# Altium project PCB_Emergencia.PrjPcb
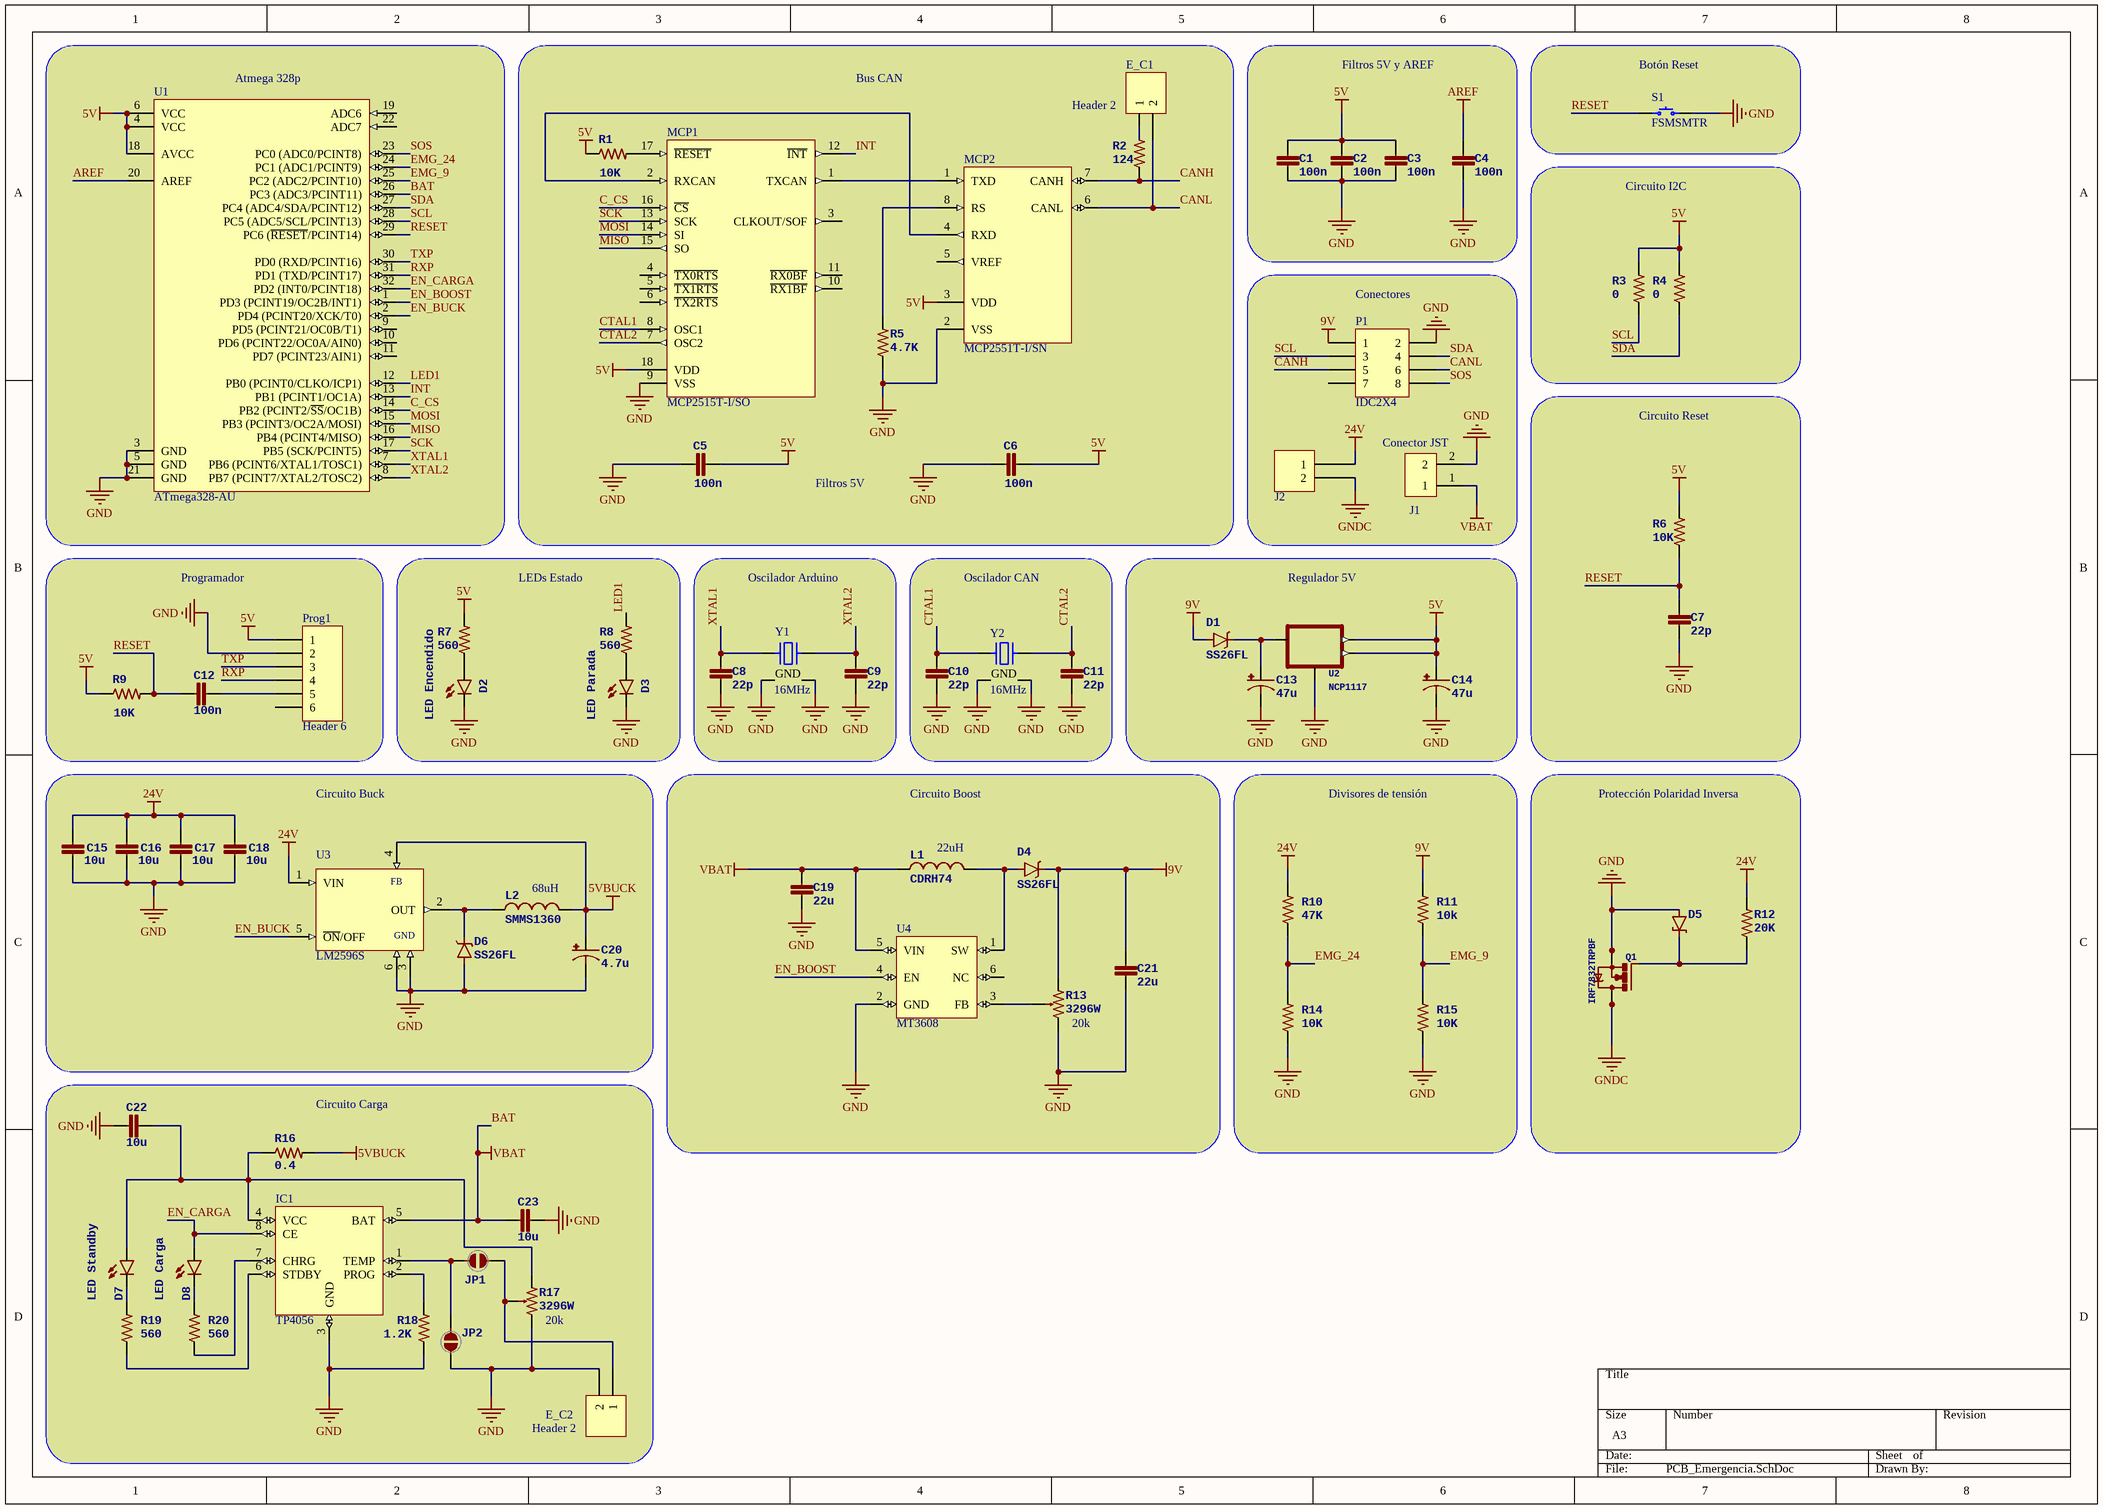
[diagram p0: PCB_Emergencia.SchDoc]
1 sheet, 72 parts. Net scope: global (net labels, ports and power ports of the same name join across sheets).
Board file: PCB_Emergencia.PcbDoc

## Sheet PCB_Emergencia.SchDoc
size A3

### Parts
C1  Cap: 100n  [0805]  (hidden comment: CapacitorStandard 0603 ceramic capacitor, and 0.1" leaded capacitor.)
C2  Cap: 100n  [0805]  (hidden comment: CapacitorStandard 0603 ceramic capacitor, and 0.1" leaded capacitor.)
C3  Cap: 100n  [0805]  (hidden comment: CapacitorStandard 0603 ceramic capacitor, and 0.1" leaded capacitor.)
C4  Cap: 100n  [0805]  (hidden comment: CapacitorStandard 0603 ceramic capacitor, and 0.1" leaded capacitor.)
C5  Cap: 100n  [0805]  (hidden comment: CapacitorStandard 0603 ceramic capacitor, and 0.1" leaded capacitor.)
C6  Cap: 100n  [0805]  (hidden comment: CapacitorStandard 0603 ceramic capacitor, and 0.1" leaded capacitor.)
C7  Cap: 22p  [0805]  (hidden comment: CapacitorStandard 0603 ceramic capacitor, and 0.1" leaded capacitor.)
C8  Cap: 22p  [0805]  (hidden comment: CapacitorStandard 0603 ceramic capacitor, and 0.1" leaded capacitor.)
C9  Cap: 22p  [0805]  (hidden comment: CapacitorStandard 0603 ceramic capacitor, and 0.1" leaded capacitor.)
C10  Cap: 22p  [0805]  (hidden comment: CapacitorStandard 0603 ceramic capacitor, and 0.1" leaded capacitor.)
C11  Cap: 22p  [0805]  (hidden comment: CapacitorStandard 0603 ceramic capacitor, and 0.1" leaded capacitor.)
C12  Cap: 100n  [0805]  (hidden comment: CapacitorStandard 0603 ceramic capacitor, and 0.1" leaded capacitor.)
C13  47u  [PANASONIC_D]
C14  47u  [PANASONIC_D]
C15  Cap: 10u  [0805]  (hidden comment: CapacitorStandard 0603 ceramic capacitor, and 0.1" leaded capacitor.)
C16  Cap: 10u  [0805]  (hidden comment: CapacitorStandard 0603 ceramic capacitor, and 0.1" leaded capacitor.)
C17  Cap: 10u  [0805]  (hidden comment: CapacitorStandard 0603 ceramic capacitor, and 0.1" leaded capacitor.)
C18  Cap: 10u  [0805]  (hidden comment: CapacitorStandard 0603 ceramic capacitor, and 0.1" leaded capacitor.)
C19  Cap: 22u  [0805]  (hidden comment: CapacitorStandard 0603 ceramic capacitor, and 0.1" leaded capacitor.)
C20  4.7u  [PANASONIC_D]
C21  Cap: 22u  [0805]  (hidden comment: CapacitorStandard 0603 ceramic capacitor, and 0.1" leaded capacitor.)
C22  Cap: 10u  [0805]  (hidden comment: CapacitorStandard 0603 ceramic capacitor, and 0.1" leaded capacitor.)
C23  Cap: 10u  [0805]  (hidden comment: CapacitorStandard 0603 ceramic capacitor, and 0.1" leaded capacitor.)
D1  SS26FL  [SS26FL]
D2  LED Encendido  [LED-1206]
D3  LED Parada  [LED-1206]
D4  SS26FL  [SS26FL]
D5  13V Zener MM1Z13  [SOD-123]  (value not drawn)
D6  SS26FL  [SS26FL]
D7  LED Standby  [LED-1206]
D8  LED Carga  [LED-1206]
E_C1  Header 2  [HDR1X2]
E_C2  Header 2  [HDR1X2]
IC1  TP4056  [*SOP-8]
J1  Conector JST  [*JST_S2B-PH-K-S(LF)(SN)]
J2  20020110-D021A01LF  [FCI 06-381-2PIN]  (value not drawn)
JP1  JUMPER-PAD-2-NC_BY_PASTE  [PAD-JUMPER-2-NC_BY_PASTE_YES_SILK]  (value not drawn)
JP2  JUMPER-PAD-2-NC_BY_PASTE  [PAD-JUMPER-2-NC_BY_PASTE_YES_SILK]  (value not drawn)
L1  CDRH74  value 22uH  [CDRH74]
L2  SMMS1360  value 68uH  [SMMS1360 - duplicate]
MCP1  MCP2515T-I/SO  [SOIC-SO18_N]
MCP2  MCP2551T-I/SN  [SOIC-SN8_N]
P1  IDC2X4  [IDC2X4]
Prog1  Header 6  [HDR1X6]
Q1  IRF7832TRPBF  [SO-08]
R1  Res: 10K  [0805]  (hidden comment: ResistorBasic schematic elements and footprints for 0603, 1206, and PTH resistors.)
R2  Res: 124  [0805]  (hidden comment: ResistorBasic schematic elements and footprints for 0603, 1206, and PTH resistors.)
R3  Res: 0  [0805]  (hidden comment: ResistorBasic schematic elements and footprints for 0603, 1206, and PTH resistors.)
R4  Res: 0  [0805]  (hidden comment: ResistorBasic schematic elements and footprints for 0603, 1206, and PTH resistors.)
R5  Res: 4.7K  [0805]  (hidden comment: ResistorBasic schematic elements and footprints for 0603, 1206, and PTH resistors.)
R6  Res: 10K  [0805]  (hidden comment: ResistorBasic schematic elements and footprints for 0603, 1206, and PTH resistors.)
R7  Res: 560  [0805]  (hidden comment: ResistorBasic schematic elements and footprints for 0603, 1206, and PTH resistors.)
R8  Res: 560  [0805]  (hidden comment: ResistorBasic schematic elements and footprints for 0603, 1206, and PTH resistors.)
R9  Res: 10K  [0805]  (hidden comment: ResistorBasic schematic elements and footprints for 0603, 1206, and PTH resistors.)
R10  Res: 47K  [0805]  (hidden comment: ResistorBasic schematic elements and footprints for 0603, 1206, and PTH resistors.)
R11  Res: 10k  [0805]  (hidden comment: ResistorBasic schematic elements and footprints for 0603, 1206, and PTH resistors.)
R12  20K  [0805]
R13  3296W  value 20k  [3296W]
R14  Res: 10K  [0805]  (hidden comment: ResistorBasic schematic elements and footprints for 0603, 1206, and PTH resistors.)
R15  Res: 10K  [0805]  (hidden comment: ResistorBasic schematic elements and footprints for 0603, 1206, and PTH resistors.)
R16  Res: 0.4  [0805]  (hidden comment: ResistorBasic schematic elements and footprints for 0603, 1206, and PTH resistors.)
R17  3296W  value 20k  [3296W]
R18  Res: 1.2K  [0805]  (hidden comment: ResistorBasic schematic elements and footprints for 0603, 1206, and PTH resistors.)
R19  Res: 560  [0805]  (hidden comment: ResistorBasic schematic elements and footprints for 0603, 1206, and PTH resistors.)
R20  Res: 560  [0805]  (hidden comment: ResistorBasic schematic elements and footprints for 0603, 1206, and PTH resistors.)
S1  FSMSMTR  [TE FSMSMTR]
U1  ATmega328-AU  [32A_N]
U2  NCP1117  [SOT223]
U3  LM2596S  [LM2596S]
U4  MT3608  [*SOT23-6]
Y1  16MHz  [NDK NX3225SA]
Y2  16MHz  [NDK NX3225SA]

### Blocks framed on the sheet
Atmega 328p: U1
Filtros 5V y AREF: C1-C4
Botón Reset: S1
Circuito I2C: R3 R4
Conectores: J1 J2 P1
Circuito Reset: C7 R6
Programador: C12 Prog1 R9
LEDs Estado: D2 D3 R7 R8
Oscilador Arduino: C8 C9 Y1
Oscilador CAN: C10 C11 Y2
Regulador 5V: C13 C14 D1 U2
Circuito Buck: C15-C18 C20 D6 L2 U3
Circuito Boost: C19 C21 D4 L1 R13 U4
Divisores de tensión: R10 R11 R14 R15
Protección Polaridad Inversa: D5 Q1 R12
Circuito Carga: C22 C23 D7 D8 E_C2 IC1 JP1 JP2 R16-R20

### Nets
5V: C1.2 C2.2 C3.2 C5.2 C6.2 C14.+ MCP1.18(VDD) MCP2.3(VDD) Prog1.1 R1.1 R3.2 R4.2 R6.2 R7.2 R9.1 U1.4(VCC) U1.6(VCC) U1.18(AVCC) U2.2(OUT) U2.4(OUT@1)
5VBUCK: C20.+ L2.PS2 R16.2 U3.4(FB)
9V: C21.1 D1.A D4.C P1.1 R11.2 R13.1
24V: C15.2 C16.2 C17.2 C18.2 J2.1 R10.2 R12.2 U3.1(VIN)
AREF: C4.2 U1.20(AREF)
BAT: C19.1 C23.1 IC1.5(BAT) J1.1 L1.1 U1.26(PC3_(ADC3/PCINT11)) U4.5(VIN)  [also labelled VBAT]
GND: C1.1 C2.1 C3.1 C4.1 C5.1 C6.1 C7.1 C8.1 C9.2 C10.1 C11.2 C13.- C14.- C15.1 C16.1 C17.1 C18.1 C19.2 C20.- C21.2 C22.2 C23.2 D2.C D3.C D5.A D6.A E_C2.2 IC1.3(GND) J1.2 JP2.1 MCP1.9(VSS) MCP2.2(VSS) P1.2 Prog1.2 Q1.1(S) Q1.2(S) Q1.3(S) R5.1 R13.3 R14.1 R15.1 R17.3 R18.1 S1.2 U1.3(GND) U1.5(GND) U1.21(GND) U2.1(ADJ) U3.3(GND) U3.6(GND@6) U4.2(GND) Y1.2(GND) Y1.4(GND) Y2.2(GND) Y2.4(GND)
GNDC: J2.2 Q1.5(D) Q1.6(D) Q1.7(D) Q1.8(D)
C_CS: MCP1.16(~{CS}) U1.14(PB2_(PCINT2/~{SS}/OC1B))
CANH: MCP2.7(CANH) P1.5 R2.1
CANL: E_C1.2 MCP2.6(CANL) P1.6
CTAL1: C10.2 MCP1.8(OSC1) Y2.1
CTAL2: C11.1 MCP1.7(OSC2) Y2.3
EMG_9: R11.1 R15.2 U1.25(PC2_(ADC2/PCINT10))
EMG_24: R10.1 R14.2 U1.24(PC1_(ADC1/PCINT9))
EN_BOOST: U1.1(PD3_(PCINT19/OC2B/INT1)) U4.4(EN)
EN_BUCK: U1.2(PD4_(PCINT20/XCK/T0)) U3.5(~{ON}/OFF)
EN_CARGA: D8.A IC1.8(CE) U1.32(PD2_(INT0/PCINT18))
INT: MCP1.12(~{INT}) U1.13(PB1_(PCINT1/OC1A))
LED1: R8.2 U1.12(PB0_(PCINT0/CLKO/ICP1))
MISO: MCP1.15(SO) U1.16(PB4_(PCINT4/MISO))
MOSI: MCP1.14(SI) U1.15(PB3_(PCINT3/OC2A/MOSI))
RESET: C7.2 C12.2 R6.1 R9.2 S1.1 U1.29(PC6_(~{RESET}/PCINT14))
RXP: Prog1.4 U1.31(PD1_(TXD/PCINT17))
SCK: MCP1.13(SCK) U1.17(PB5_(SCK/PCINT5))
SCL: P1.3 R3.1 U1.28(PC5_(ADC5/SCL/PCINT13))
SDA: P1.4 R4.1 U1.27(PC4_(ADC4/SDA/PCINT12))
SOS: P1.8 U1.23(PC0_(ADC0/PCINT8))
TXP: Prog1.3 U1.30(PD0_(RXD/PCINT16))
XTAL1: C8.2 U1.7(PB6_(PCINT6/XTAL1/TOSC1)) Y1.1
XTAL2: C9.1 U1.8(PB7_(PCINT7/XTAL2/TOSC2)) Y1.3
NetC12_1: C12.1 Prog1.5
NetC13_+: C13.+ D1.C U2.3(IN)
NetC22_1: C22.1 D7.A IC1.4(VCC) R16.1 R17.1
NetD2_A: D2.A R7.1
NetD3_A: D3.A R8.1
NetD4_A: D4.A L1.2 U4.1(SW)
NetD5_C: D5.C Q1.4(G) R12.1
NetD6_C: D6.C L2.PS1 U3.2(OUT)
NetD7_C: D7.C R19.2
NetD8_C: D8.C R20.2
NetE_C1_1: E_C1.1 R2.2
NetE_C2_1: E_C2.1 JP1.2 R17.2
NetIC1_1: IC1.1(TEMP) JP1.1 JP2.2
NetIC1_2: IC1.2(PROG) R18.2
NetIC1_6: IC1.6(STDBY) R19.1
NetIC1_7: IC1.7(CHRG) R20.1
NetMCP1_1: MCP1.1(TXCAN) MCP2.1(TXD)
NetMCP1_2: MCP1.2(RXCAN) MCP2.4(RXD)
NetMCP1_17: MCP1.17(~{RESET}) R1.2
NetMCP2_8: MCP2.8(RS) R5.2
NetR13_2: R13.2 U4.3(FB)

Not connected (* = marked no-connect by the designer): MCP1 3(CLKOUT/SOF) 4(~{TX0RTS}) 5(~{TX1RTS}) 6(~{TX2RTS}) 10(~{RX1BF}) 11(~{RX0BF}); MCP2 5(VREF); P1 7; Prog1 6; U1 9(PD5_(PCINT21/OC0B/T1)) 10(PD6_(PCINT22/OC0A/AIN0)) 11(PD7_(PCINT23/AIN1)) 19(ADC6) 22(ADC7); U4 6(NC)

### Notes on the sheet
- Bus CAN
- Filtros 5V

### Library data of the parts
C1-C12 C15-C19 C21-C23 = CAP0805
C13 C14 C20 = 47UF-50V-20%(ELECT): PROD_ID: CAP-10547
D2 D3 D7 D8 = LED1206
D5 = DIODE-ZENER16V: PROD_ID: DIO-12440
E_C1 E_C2 = Header 2: Header, 2-Pin; LatestRevisionDate: 17-Jul-2002; LatestRevisionNote: Re-released for DXP Platform.; Publisher: Altium Limited
IC1 = TP4056: MF: NanJing Top Power ASIC Corp.; Availability: Unavailable; Package: Package Analog Devices; Price: None; SnapEDA_Link: https://www.snapeda.com/parts/TP4056%20/NanJing%20Top%20Power%20ASIC%20Corp./view-part/?ref=snap; MP: TP4056; Value: *
J1 = S2B-PH-K-S(LF)(SN): PH Series 2 Position 2.0 mm Through Hole Side Entry Shrouded Header; MP: S2B-PH-K-S_LF__SN_; MF: JST Sales; SnapEDA_Link: https://www.snapeda.com/parts/S2B-PH-K-S%28LF%29%28SN%29/JST%20Sales%20America%20Inc./view-part/?ref=snap; Price: None; Availability: Unavailable; Package: None; Value: *
J2 = 20020110-D021A01LF: TERM BLOCK HDR 2POS R/A 3.81MM; Manufacturer: FCI; TemperatureRange: -40C ~ 115C; Voltage: 300V; Pitch: 0.150" (3.81mm); Number Of Positions: 2; Number Of Levels: 1; Part Number: 20020110-D021A01LF; PartId: 7785; Supplier 1: Digi-Key; Supplier Part Number 1: 609-3819-ND; ComponentLink1Description: Datasheet; ComponentLink1URL: http://portal.fciconnect.com/Comergent//fci/drawing/20020110.pdf; ComponentLink2Description: Digi-Key Listing; ComponentLink2URL: http://www.digikey.ca/product-detail/en/20020110-D021A01LF/609-3819-ND/2261255; Price: 0,75; Type: Through Hole; Colour: Green; Orientation: 90, Right Angle; Positions Per Level: 2
L2 = INDUCTOR
MCP1 = MCP2515T-I/SO: Stand-Alone CAN Controller With SPI Interface, 18-Pin SOIC, Industrial Temperature, Tape and Reel; Published: 29-Jan-2009; DatasheetVersion: revE, Nov-2007; PackageVersion: revBB, Aug-2009; PackageReference: SOIC-SO18; Publisher: Altium Limited; PackageDescription: 18-Lead Plastic Small Outline (SO) - Wide 7.50mm Body [SOIC]; Supplier 1: Digi-Key; Supplier Part Number 1: MCP2515T-I/SO-ND; Supplier 2: Farnell; Supplier Part Number 2: 1815922; Code_JEDEC: MS-013; ComponentLink1Description: Datasheet; ComponentLink1URL: http://ww1.microchip.com/downloads/en/DeviceDoc/21801e.pdf; ComponentLink2Description: Packaging Specification; ComponentLink2URL: http://www.microchip.com/stellent/groups/techpub_sg/documents/packagingspec/en012702.pdf; ComponentLink3Description: Microchip.com Home; ComponentLink3URL: http://www.microchip.com/
MCP2 = MCP2551T-I/SN: High-Speed CAN Transceiver, 8-Pin SOIC, Industrial Temperature, Tape and Reel; Published: 29-Jan-2009; DatasheetVersion: revE, Jan-2007; PackageVersion: revBB, Aug-2009; PackageReference: SOIC-SN8; Publisher: Altium Limited; PackageDescription: 8-Lead Plastic Small Outline (SN) - Narrow, 3.90mm Body [SOIC]; Supplier 1: Digi-Key; Supplier Part Number 1: MCP2551T-I/SNTR-ND; Supplier 2: Farnell; Supplier Part Number 2: 1788569; Code_JEDEC: MS-012; Code_IPC: SOIC127P600-8; ComponentLink1Description: Datasheet; ComponentLink1URL: http://ww1.microchip.com/downloads/en/DeviceDoc/21667E.pdf; ComponentLink2Description: Packaging Specification; ComponentLink2URL: http://www.microchip.com/stellent/groups/techpub_sg/documents/packagingspec/en012702.pdf; ComponentLink3Description: Microchip.com Home; ComponentLink3URL: http://www.microchip.com/
P1 = IDC2X4: Header, 4-Pin, Dual row; LatestRevisionDate: 17-Jul-2002; LatestRevisionNote: Re-released for DXP Platform.; Publisher: Altium Limited
Prog1 = Header 6: Header, 6-Pin; LatestRevisionDate: 17-Jul-2002; LatestRevisionNote: Re-released for DXP Platform.; Publisher: Altium Limited
Q1 = N-MOSFET-SO8S
R1-R12 R14-R16 R18-R20 = RESISTOR0805-RES
S1 = FSMSMTR: SWITCH TACTILE SPST-NO 0.05A 24V; Manufacturer: TE Connectivity Alcoswitch Switches; Switch Function: Off-Mom; Contact Rating @ Voltage: 0.05A @ 24VDC; Actuator Type: Standard; Actuator Orientation: Top Actuated; Illumination: Non-Illuminated; Operating Force: 180gf; Switch Travel: 0.25mm; Mechanical Life: 20,000 Cycles; Part Number: FSMSMTR; PartId: 8251; Supplier 1: Digi-Key; Supplier Part Number 1: 450-1758-2-ND; ComponentLink1Description: Datasheet; ComponentLink1URL: http://www.te.com/commerce/DocumentDelivery/DDEController?Action=srchrtrv&DocNm=1437566-3&DocType=Customer+Drawing&DocLang=English; ComponentLink2Description: Digi-Key Listing; ComponentLink2URL: http://www.digikey.com/product-detail/en/FSMSMTR/450-1758-2-ND/529671; Price: 0,175; Circuit: SPST-NO; Illumination Voltage: -; Illumination Type, Colour: -; Operating Temperature: -35C ~ 85C
U1 = ATmega328-AU: 8-bit AVR Microcontroller, 32KB Flash, 1KB EEPROM, 2KB SRAM, 32-pin TQFP, Industrial Grade (-40°C to 85°C); Published: 1-Apr-2010; DatasheetVersion: revA, Jan-2010; PackageVersion: revB, Oct-2001; PackageReference: 32A; Publisher: Altium Limited; PackageDescription: 32-Lead, 7x7x1.0 mm Body, 0.8mm Lead Pitch, Thin Profile Plastic Quad Flat Package (TQFP); Supplier 1: Digi-Key; Supplier Part Number 1: ATMEGA328-AU-ND; Supplier 2: Mouser; Supplier Part Number 2: 556-ATMEGA328-AU; Code_JEDEC: MS-026-ABA; ComponentLink1Description: Manufacturer Link; ComponentLink1URL: http://www.atmel.com/products/avr/default.asp?; ComponentLink2Description: ATmega48A/48PA/88A/88PA/168A/168PA/328/328P Datasheet; ComponentLink2URL: http://www.atmel.com/dyn/resources/prod_documents/8271.pdf; ComponentLink3Description: ATmega48A/48PA/88A/88PA/168A/168PA/328/328P Summary; ComponentLink3URL: http://www.atmel.com/dyn/resources/prod_documents/8271S.pdf; ComponentLink4Description: Atmel.com Home; ComponentLink4URL: http://www.atmel.com
U2 = V_REG_LM1117SOT223: PROD_ID: VREG-08170
U3 = LM2596S: Semiconductors and Actives; MF: Texas Instruments; SnapEDA_Link: https://www.snapeda.com/parts/LM2596S/Texas%20Instruments/view-part/?ref=snap; Price: None; MP: LM2596S; Availability: Unavailable; Package: None; Value: *
U4 = MT3608: High Efficiency 1.2MHz / 2A Step Up Converter; MF: Aerosemi Technology Co., Ltd; Price: None; SnapEDA_Link: https://www.snapeda.com/parts/MT3608/Aerosemi%20Technology%20Co.%2C%20Ltd/view-part/?ref=snap; Availability: Unavailable; Package: Package Analog Devices; MP: MT3608; Value: *
Y1 Y2 = NX3225SA-16.000MHZ-STD-CSR-1: CRYSTAL 16.0000MHZ 8PF SMD; Manufacturer: NDK; Frequency Stability: 15ppm; ESR: 80 Ohm; Operating Mode: Fundamental; Part Number: NX3225SA-16.000MHZ-STD-CSR-1; PartId: 8509; Supplier 1: Digi-Key; Supplier Part Number 1: 644-1049-2-ND; ComponentLink1Description: Datasheet; ComponentLink1URL: http://media.digikey.com/pdf/Data%20Sheets/NDK%20PDFs/NX3225SA.pdf; ComponentLink2Description: Digi-Key Listing; ComponentLink2URL: http://www.digikey.com/product-detail/en/NX3225SA-16.000MHZ-STD-CSR-1/644-1049-2-ND/1128831; Price: 0,3799; Type: MHz Crystal; Device Package: 4-SMD, No Lead (DFN, LCC); Frequency: 16MHz; Frequency Tolerance: 15ppm; Load Capacitance: 8pF
D1 D4 D6 = SS26FL: PROD_ID: SS26FL